# Altium schematic sheet ATX_Interface.SchDoc
size A; SheetNumber: 2; SheetTotal: 16
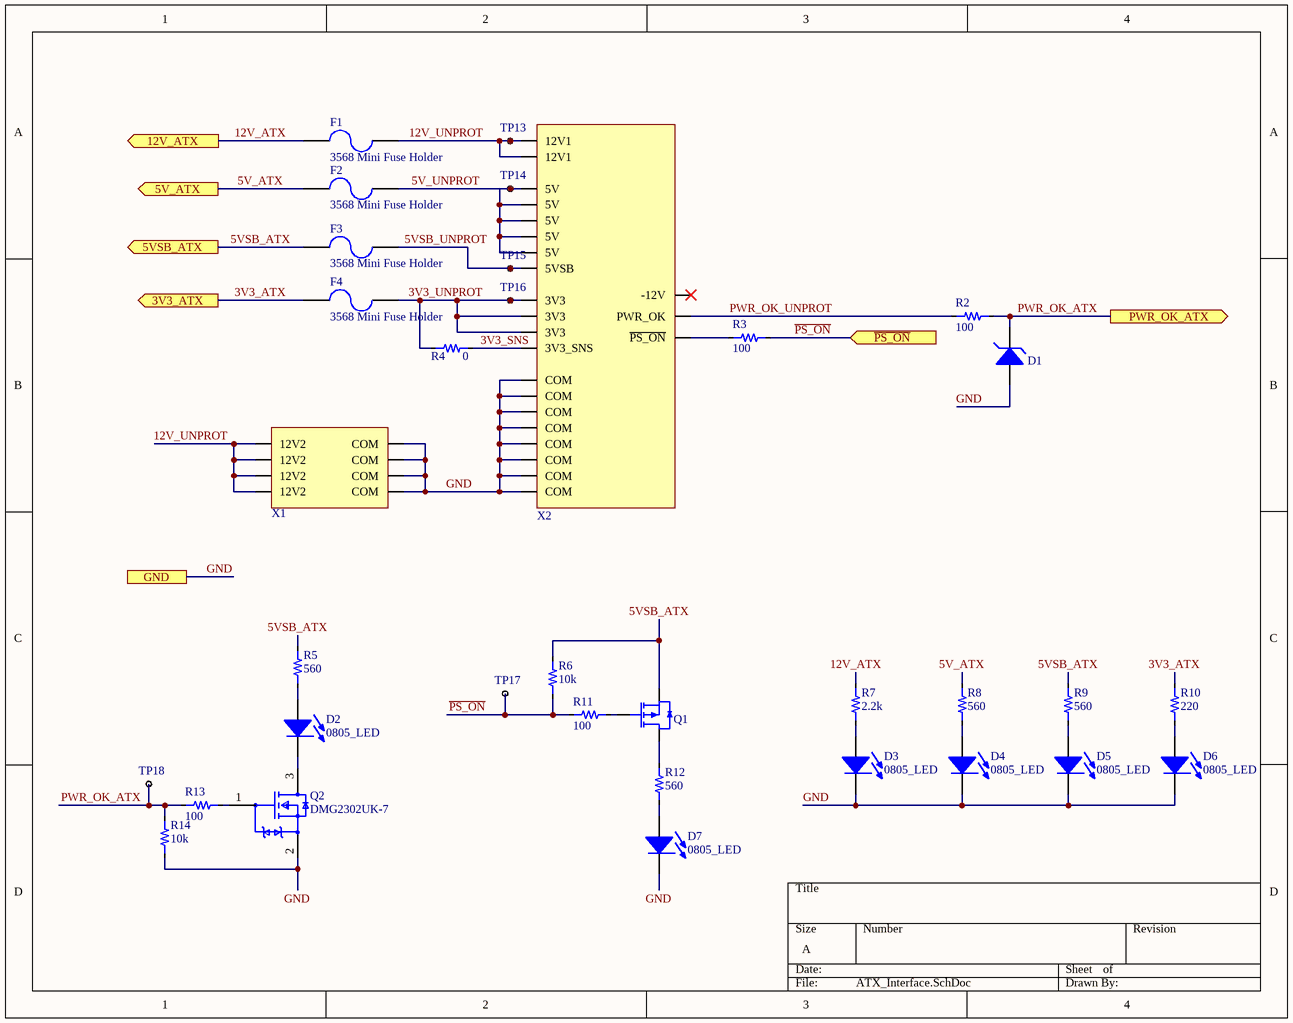
[diagram p0: ATX_Interface.SchDoc]

## Parts
D1  SZMMSZ5227BT1G  [SOD-123]  (value not drawn)
D2  0805_LED  [0805_LED]
D3  0805_LED  [0805_LED]
D4  0805_LED  [0805_LED]
D5  0805_LED  [0805_LED]
D6  0805_LED  [0805_LED]
D7  0805_LED  [0805_LED]
F1  3568 Mini Fuse Holder  [3568MiniFuseHolder]
F2  3568 Mini Fuse Holder  [3568MiniFuseHolder]
F3  3568 Mini Fuse Holder  [3568MiniFuseHolder]
F4  3568 Mini Fuse Holder  [3568MiniFuseHolder]
Q1  MOSFET P-CH 30V 2A SOT-23  [SOT23-3]  (value not drawn)
Q2  DMG2302UK-7  [SOT23-3]
R2  value 100  [0603_RES]  (hidden comment: Resistor)
R3  value 100  [0603_RES]  (hidden comment: Resistor)
R4  value 0  [0603_RES]  (hidden comment: Resistor)
R5  value 560  [0603_RES]  (hidden comment: Resistor)
R6  value 10k  [0603_RES]  (hidden comment: Resistor)
R7  value 2.2k  [0603_RES]  (hidden comment: Resistor)
R8  value 560  [0603_RES]  (hidden comment: Resistor)
R9  value 560  [0603_RES]  (hidden comment: Resistor)
R10  value 220  [0603_RES]  (hidden comment: Resistor)
R11  value 100  [0603_RES]  (hidden comment: Resistor)
R12  value 560  [0603_RES]  (hidden comment: Resistor)
R13  value 100  [0603_RES]  (hidden comment: Resistor)
R14  value 10k  [0603_RES]  (hidden comment: Resistor)
TP13  1mm Testpoint  [1mm_testpoint]  (value not drawn)
TP14  1mm Testpoint  [1mm_testpoint]  (value not drawn)
TP15  1mm Testpoint  [1mm_testpoint]  (value not drawn)
TP16  1mm Testpoint  [1mm_testpoint]  (value not drawn)
TP17  1mm Testpoint  [1mm_testpoint]  (value not drawn)
TP18  1mm Testpoint  [1mm_testpoint]  (value not drawn)
X1  ATX 8 Pin Aux Power  [MOLEX 039299042]  (value not drawn)
X2  ATX 24 Pin Main Power  [MOLEX 44206-000X]  (value not drawn)

## Ports
3V3_ATX (out), 5V_ATX (out), 5VSB_ATX (out), 12V_ATX (out), GND, PWR_OK_ATX (out), ~{PS_ON} (in)

## Nets
3V3_ATX: F4.1 R10.2 ; port 3V3_ATX
3V3_SNS: R4.2 X2.13(3V3_SNS)
3V3_UNPROT: F4.2 R4.1 TP16.1 X2.1(3V3) X2.2(3V3) X2.12(3V3)
5V_ATX: F2.1 R8.2 ; port 5V_ATX
5V_UNPROT: F2.2 TP14.1 X2.4(5V) X2.6(5V) X2.21(5V) X2.22(5V) X2.23(5V)
5VSB_ATX: F3.1 Q1.2(S) R5.2 R6.2 R9.2 ; port 5VSB_ATX
5VSB_UNPROT: F3.2 TP15.1 X2.9(5VSB)
12V_ATX: F1.1 R7.2 ; port 12V_ATX
12V_UNPROT: F1.2 TP13.1 X1.5(12V2) X1.6(12V2) X1.7(12V2) X1.8(12V2) X2.10(12V1) X2.11(12V1)
GND: D1.2(A) D3.2(K) D4.2(K) D5.2(K) D6.2(K) D7.2(K) Q2.2(S) R14.2 X1.1(COM) X1.2(COM) X1.3(COM) X1.4(COM) X2.3(COM) X2.5(COM) X2.7(COM) X2.15(COM) X2.17(COM) X2.18(COM) X2.19(COM) X2.24(COM) ; port GND
~{PS_ON}: R3.1 R6.1 R11.2 TP17.1 ; port ~{PS_ON}
PWR_OK_ATX: D1.1(K) R2.1 R13.2 R14.1 TP18.1 ; port PWR_OK_ATX
PWR_OK_UNPROT: R2.2 X2.8(PWR_OK)
NetD2_1: D2.1(A) R5.1
NetD2_2: D2.2(K) Q2.3(D)
NetD3_1: D3.1(A) R7.1
NetD4_1: D4.1(A) R8.1
NetD5_1: D5.1(A) R9.1
NetD6_1: D6.1(A) R10.1
NetD7_1: D7.1(A) R12.1
NetQ1_1: Q1.1(G) R11.1
NetQ1_3: Q1.3(D) R12.2
NetQ2_1: Q2.1(G) R13.1
NetR3_2: R3.2 X2.16(~{PS_ON})

Not connected (* = marked no-connect by the designer): X2 14(-12V)*

## Library data of the parts
D1 = SZMMSZ5227BT1G: Zener Diode 3.6 V 500 mW ±5% Surface Mount SOD-123; Vr: 3.6; Num_Circuits: 1; Package: SOD-123; ComponentLink1Description: Digikey; ComponentLink1URL: https://www.digikey.com/en/products/detail/onsemi/SZMMSZ5227BT1G/3063346
D2-D7 = 0805_LED: Generic 0805 LED; Color: Green
F1-F4 = 3568 Mini Fuse Holder: Fuse Holder 30A 500V 1 Circuit Blade Through Hole; ComponentLink1Description: Digikey; ComponentLink1URL: https://www.digikey.com/product-detail/en/keystone-electronics/3568/36-3568-ND/2137306; Max Current: 30A; Max Voltage: 500V
Q1 = STR2P3LLH6: P-Channel 2A (Ta) 350mW (Tc) Surface Mount SOT-23; Type: P Channel; VdsMax: 30; Num_Circuits: 1; Current: 2; RdsOn: 56; Vt: 10; VgsMax: 20; Package: SOT-23; ComponentLink1Description: Digikey; ComponentLink1URL: https://www.digikey.com/en/products/detail/stmicroelectronics/STR2P3LLH6/5244876; ComponentLink2Description: Datasheet; ComponentLink2URL: https://www.st.com/content/ccc/resource/technical/document/datasheet/96/4a/55/9d/3c/16/47/d6/DM00084050.pdf/files/DM00084050.pdf/jcr:content/translations/en.DM00084050.pdf
Q2 = DMG2302UK-7: MOSFET N-CH 20V 2.8A SOT23; Manufacturer: Diodes Inc.; Reverse Recovery Time: 5.3ns; Gate Charge At Vgs: 2.8nC @ 10V; Turn On Delay Time: 0.6ns; Pulse Drain Current: 12A; Max Forward Diode Voltage: 1.2V; Reverse Recovery Charge: 0.5nC; Automotive Grade: Grade 0; Threshold Vgs Min: 0.3V; Number Of N Channels: 1; Standoff Height: 0.013mm; Typ Forward Diode Voltage: 0.7V; Drain To Source Resistance: 61mΩ; Rthja Max: 192°C/W; Max Junction Temp: +150°C; Input Capacitace At Vds: 130pF @ 10V; Threshold Vgs Max: 1V; Turn Off Delay Time: 4.2ns; Depletion Mode: False; Gate To Source Voltage: 12V; Power Dissipation: 0.66W; Device Class L1: Discrete Semiconductors; Footprint Url: https://www.diodes.com/assets/Package-Files/SOT23.pdf; Lead Free: Yes; Manufacturer Part Number: DMG2302UK-7; Temperature Range High: +150°C; Drain To Source Voltage: 20V; Category: Trans; Digikey Description: MOSFET N-CH 20V 2.8A SOT23; RoHS: TRUE; Device Class L2: Transistors; Height: 1.1mm; Automotive: Yes; Package: SOT23; Drain To Source Breakdown Voltage: 20V; Continuous Drain Current: 2.8A; ComponentLink2Description: Datasheet; Device Class L3: MOSFETs; Octopart: https://octopart.com/dmg2302uk-7-diodes+inc.-73850182; Temperature Range Low: -55°C; Temperature: -55°C to +150°C; Number Of Channels: 1; ComponentLink2URL: https://www.diodes.com/assets/Datasheets/DMG2302UK.pdf
TP13-TP18 = 1mm Testpoint: 1mm test point; ComponentLink1Description: Digikey; ComponentLink1URL: https://www.digikey.com/product-detail/en/te-connectivity-amp-connectors/RCU-0C/A106145CT-ND/3477802
X1 = ATX 8 Pin Aux Power: ATX Aux Power 8 Pin Connector; MfrPartNo: 0039299082; ComponentLink1Description: Digikey; ComponentLink1URL: https://www.digikey.com/en/products/detail/molex/0039299082/1624283
X2 = ATX 24 Pin Main Power: ATX Main Power 24 Pin Connector; MfrPartNo: 0442060007; ComponentLink1Description: Digikey; ComponentLink1URL: https://www.digikey.com/en/products/detail/molex/0442060007/3311018
R2-R14 = Resistor: Tolerance: *